# EAGLE design driver1 (EAGLE 6.1)
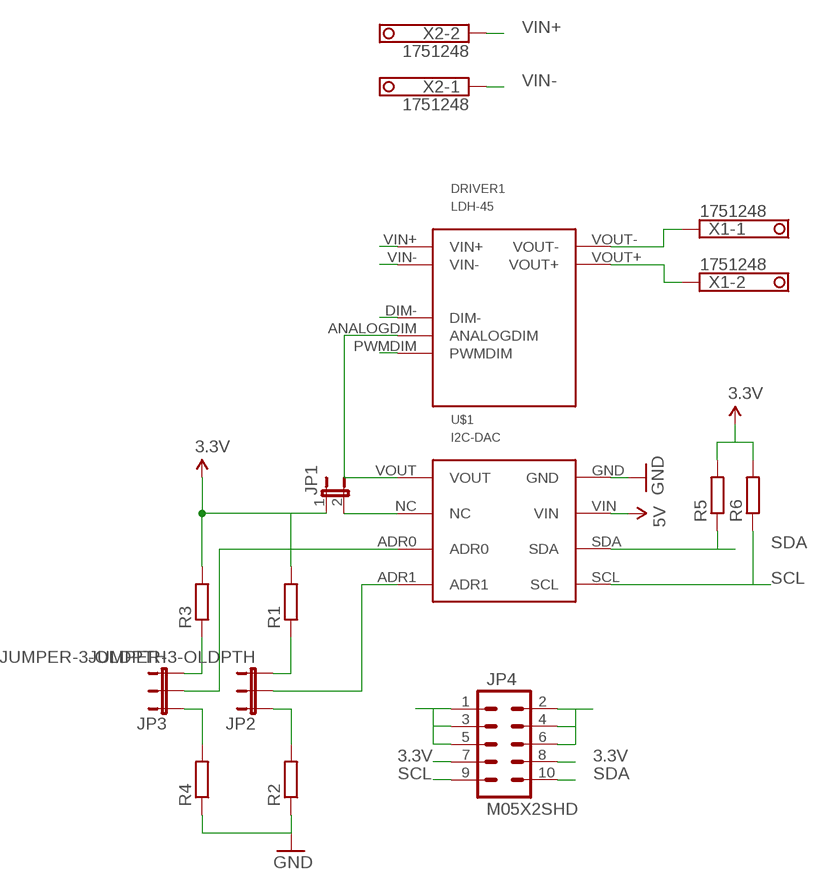
[diagram p0: schematic, sheet 1]

## Parts
DRIVER1  LDH-45  [LDH-45]
JP1  JUMPER-2PTH_LOCK  [1X02_LOCK]
JP2  JUMPER-3-OLDPTH  [1X03]
JP3  JUMPER-3-OLDPTH  [1X03]
JP4  M05X2SHD  [2X5-SHROUDED]
R1  R-EU_R0603  [R0603]
R2  R-EU_R0603  [R0603]
R3  R-EU_R0603  [R0603]
R4  R-EU_R0603  [R0603]
R5  R-EU_R0603  [R0603]
R6  R-EU_R0603  [R0603]
U$1  I2C-DAC  [I2C-DAC]
X1  1751248  [1751248]
X2  1751248  [1751248]

## Nets
3.3V: JP1.1 JP4.7 JP4.8 R1.2 R3.2 R5.2 R6.2
5V: JP4.2 JP4.4 JP4.6 U$1.VIN
GND: JP4.1 JP4.3 JP4.5 R2.1 R4.1 U$1.GND
N$1: DRIVER1.VOUT- X1.1
N$2: DRIVER1.VOUT+ X1.2
N$3: DRIVER1.DIM-
N$4: DRIVER1.ANALOGDIM U$1.VOUT
N$5: DRIVER1.PWMDIM
N$6: JP3.2 U$1.ADR0
N$7: JP3.3 R3.1
N$8: JP1.2 U$1.NC
N$9: JP3.1 R4.2
N$10: JP2.3 R1.1
N$11: JP2.1 R2.2
N$14: JP2.2 U$1.ADR1
SCL: JP4.9 R6.1 U$1.SCL
SDA: JP4.10 R5.1 U$1.SDA
VIN+: DRIVER1.VIN+ X2.2
VIN-: DRIVER1.VIN- X2.1

## Library data of the parts
DRIVER1 = wes:LDH-45
JP1 = SparkFun-Passives:JUMPER-2: Jumper Basic 0.1" spaced jumper. Use with breakaway headers.
JP2 JP3 = SparkFun-Passives:JUMPER-3-OLD
JP4 = SparkFun-Connectors:M05X2: Header 5x2 Standard 10-pin dual row 0.1" header. Commonly used with AVR-ISP. Use with Spark Fun Electronics SKU: PRT-00778
R1-R6 = resistor:R-EU_: RESISTOR, European symbol
U$1 = wes:I2C-DAC
X1 X2 = con-phoenix-350:1751248: MKDS 1/ 2-3,5 Printklemme Nennstrom: 10 A Bemessungsspannung: 160 V Raster: 3,5 mm Polzahl: 2 Montageart: Löten Anschlussart: Schraubanschluss Anschlussrichtung vom Leiter zur Platine: 0° Source: http://eshop.phoenixcontact.com .. 1751248.pdf; OC_FARNELL: unknown; OC_NEWARK: unknown

## Board
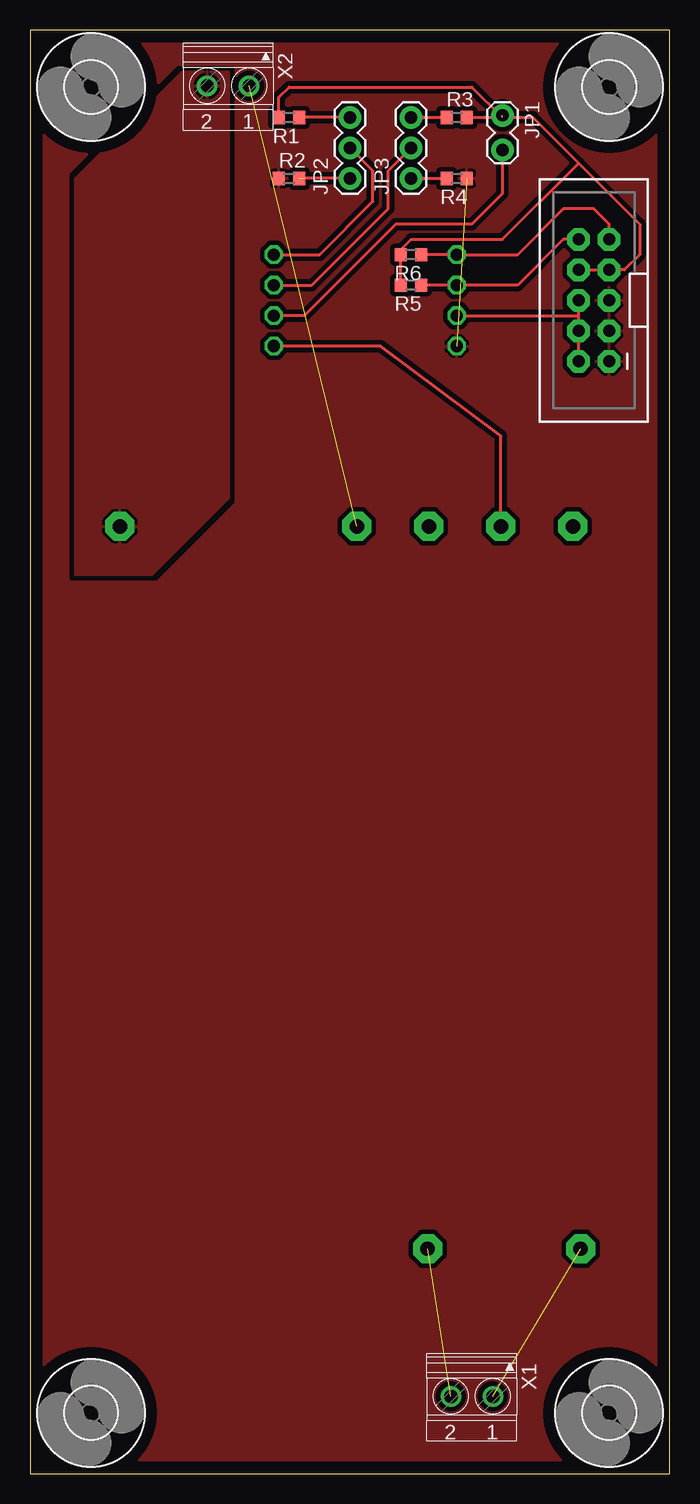
[diagram p1: board, top side]

Size 53.32 x 120.32 mm. Coordinates in mm from the lower left corner, seen from the top.
Outline: 0,0 53.32,0 53.32,120.32 0,120.32 0,0
Copper layers (1*16): Top 0.035mm / dielectric 1.5mm / Bottom 0.035mm
Design rules: minimum track width 10mil, minimum drill 24mil, track to track 8mil, track to pad 8mil, pad to pad 8mil, via to via 8mil, smd to smd 8mil, copper to edge 40mil, drill to drill 8mil, minimum pad ring 10mil, minimum via ring 8mil, stop-mask expansion 4mil, vias tented up to drill 0mil, thermal gap 10mil

### Footprints (pad centres in the part's own frame; a part is rotated, then mirrored left to right if it is on the bottom)
LDH-45 = drill 1.2 pad 2.4 octagon: ANALOGDIM 14.1,-7.4; DIM- 20.1,-7.4; PWMDIM 8.1,-7.4; VIN+ 45.85,-7.4; VIN- 26.1,-7.4; VOUT+ 20.2,-67.6; VOUT- 7.45,-67.6
1X02_LOCK = drill 1.016 pad 1.88: 1 -0.178,0; 2 2.718,0
1X03 = drill 1.016 pad 1.88: 1 0,0; 2 2.54,0; 3 5.08,0
2X5-SHROUDED = drill 1.016 pad 1.88 octagon: 1 -1.27,5.08; 2 1.27,5.08; 3 -1.27,2.54; 4 1.27,2.54; 5 -1.27,0; 6 1.27,0; 7 -1.27,-2.54; 8 1.27,-2.54; 9 -1.27,-5.08; 10 1.27,-5.08
R0603 = smd 1 x 1.1: 1 -0.85,0; 2 0.85,0
I2C-DAC = drill 1.016 octagon: ADR0 -7.62,-1.27; ADR1 -7.62,-3.81; GND 7.62,3.81; NC -7.62,1.27; SCL 7.62,-3.81; SDA 7.62,-1.27; VIN 7.62,1.27; VOUT -7.62,3.81
4,3 = hole 4.3: 0,0
1751248 = drill 1.1 pad 1.7: 1 -1.75,-0.1; 2 1.75,-0.1

### Placement (x,y rotation side)
DRIVER1  53.34,86.36 0 bottom
JP1  39.37,113.03 270 top
JP2  26.67,107.95 90 top
JP3  31.75,107.95 90 top
JP4  46.99,97.79 180 top
R1  21.59,113.03 180 top
R2  21.59,107.95 0 top
R3  35.56,113.03 0 top
R4  35.56,107.95 180 top
R5  31.75,99.06 180 top
R6  31.75,101.6 180 top
U$1  27.94,97.79 180 bottom
U$2  [4,3]  5.08,115.57 0 top
U$3  [4,3]  48.26,115.57 0 top
U$4  [4,3]  5.08,5.08 0 top
U$5  [4,3]  48.26,5.08 0 top
X1  36.83,6.35 180 top
X2  16.51,115.57 180 top

### Tracks (layer width: path | path; a pad name or v marks a point on that pad's centre or on a via)
3.3V  (1 unrouted)
  Top 0.254: R1.2 20.74,114.72 21.59,115.57 36.83,115.57 39.37,113.03 41.91,113.03 45.72,109.22 | JP4.8 JP4.7 49.53,100.33 50.8,101.6 50.8,104.14 45.72,109.22 | R3.2 39.19,113.03 JP1.1 | R5.2 R6.2 30.9,102.02 31.75,102.87 39.37,102.87 45.72,109.22
5V
  Top 0.254: JP4.2 JP4.4 45.72,96.52 | 45.72,96.52 JP4.6 | U$1.VIN 45.72,96.52
GND  (1 unrouted)
  pour Top (isolate 0.4, rank 6): 0,120.02 53.34,120.02 53.34,0 0,0
N$1  (1 unrouted)
N$2  (1 unrouted)
N$4
  Top 0.254: DRIVER1.ANALOGDIM 39.24,86.49 29.21,93.98 U$1.VOUT
N$6
  Top 0.254: U$1.ADR0 23.5,99.06 29.84,105.41 29.84,108.58 JP3.2
N$7
  Top 0.254: JP3.3 R3.1
N$8
  Top 0.254: JP1.2 39.37,106.68 36.83,104.14 30.48,104.14 22.86,96.52 U$1.NC
N$9
  Top 0.254: JP3.1 R4.2
N$10
  Top 0.254: JP2.3 R1.1
N$11  (1 unrouted)
  Top 0.254: JP2.1 22.86,107.95
N$14
  Top 0.254: U$1.ADR1 24.13,101.6 28.57,106.05 28.57,108.58 JP2.2
SCL
  Top 0.254: JP4.9 48.26,104.14 46.99,105.41 44.45,105.41 40.64,101.6 U$1.SCL R6.1
SDA
  Top 0.254: R5.1 U$1.SDA 40.64,99.06 44.45,102.87 JP4.10
VIN+
  pour Top (isolate 0.4): 3.81,74.93 3.81,107.95 12.7,116.84 16.51,116.84 16.51,81.28 10.16,74.93
VIN-  (1 unrouted)